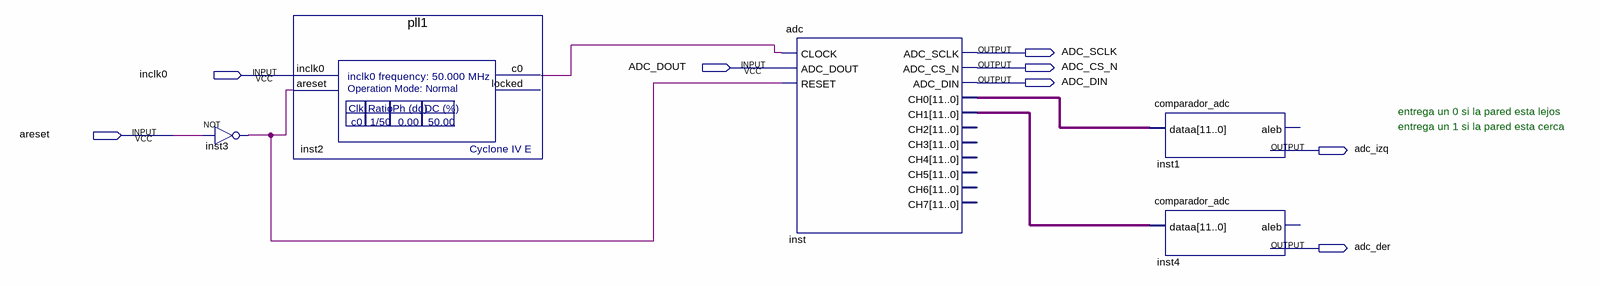
[diagram p0: schematic sheet]
// Quartus schematic esqumaticoADC.bdf as structural Verilog: 5 symbols, 8 pins
module esqumaticoADC (
  input  ADC_DOUT,
  input  inclk0,
  input  areset,
  output ADC_SCLK,
  output ADC_CS_N,
  output ADC_DIN,
  output adc_izq,
  output adc_der
);

  wire inst2_c0, inst3_out;
  wire [11:0] inst_ch0, inst_ch1;

  not inst3 (inst3_out, areset);
  pll1 inst2 (.inclk0(inclk0), .areset(inst3_out), .c0(inst2_c0));  // open: locked
  adc inst (
    .CLOCK(inst2_c0), .ADC_DOUT(ADC_DOUT), .RESET(inst3_out), .ADC_SCLK(ADC_SCLK), .ADC_CS_N(ADC_CS_N),
    .ADC_DIN(ADC_DIN), .CH0(inst_ch0), .CH1(inst_ch1));  // open: CH2, CH3, CH4, CH5, CH6, CH7
  comparador_adc inst1 (.dataa(inst_ch0));  // open: aleb
  comparador_adc inst4 (.dataa(inst_ch1));  // open: aleb

  // Notes on the sheet:
  //   entrega un 0 si la pared esta lejos
  //   entrega un 1 si la pared esta cerca
endmodule
